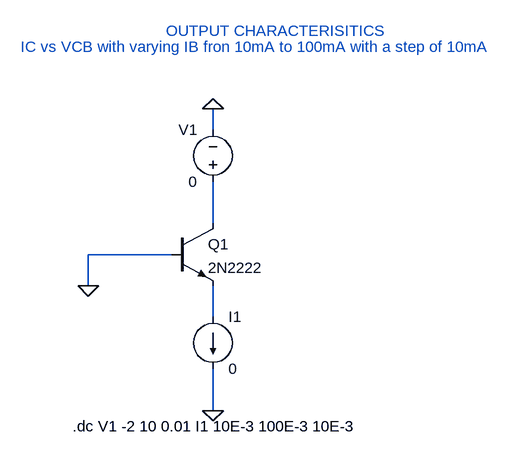
[diagram p0: schematic BJT_CB_Output_characteristics.asc]
BJT_CB_Output_characteristics.asc, the LTspice schematic file:
Version 4
SHEET 1 880 680
WIRE -176 -544 -176 -576
WIRE -176 -400 -176 -464
WIRE -240 -352 -368 -352
WIRE -368 -304 -368 -352
WIRE -176 -256 -176 -304
WIRE -176 -112 -176 -176
FLAG -368 -304 0
FLAG -176 -112 0
FLAG -176 -576 0
SYMBOL npn -240 -400 R0
SYMATTR InstName Q1
SYMATTR Value 2N2222
SYMBOL voltage -176 -448 R180
WINDOW 0 24 96 Left 2
WINDOW 3 24 16 Left 2
WINDOW 123 0 0 Left 2
WINDOW 39 0 0 Left 2
SYMATTR InstName V1
SYMATTR Value 0
SYMBOL current -176 -256 R0
WINDOW 123 0 0 Left 2
WINDOW 39 0 0 Left 2
SYMATTR InstName I1
SYMATTR Value 0
TEXT -392 -88 Left 2 !.dc V1 -2 10 0.01 I1 10E-3 100E-3 10E-3
TEXT -472 -672 Left 2 ;IC vs VCB with varying IB fron 10mA to 100mA with a step of 10mA
TEXT -248 -696 Left 2 ;OUTPUT CHARACTERISITICS

The netlist it stands for:
* BJT_CB_Output_characteristics.asc
Q1 N001 0 N002 0 2N2222
V1 N001 0 0
I1 N002 0 0
.model NPN NPN
.model PNP PNP
.lib standard.bjt
.dc V1 -2 10 0.01 I1 10E-3 100E-3 10E-3
* IC vs VCB with varying IB fron 10mA to 100mA with a step of 10mA
* OUTPUT CHARACTERISITICS
.backanno
.end